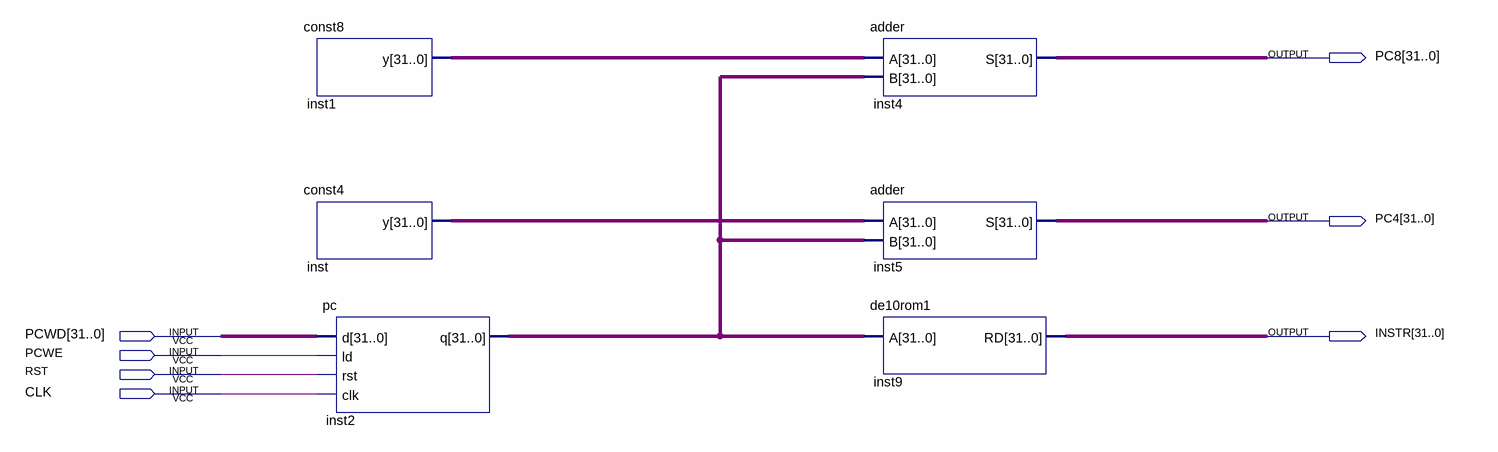
[diagram p0: schematic sheet]
// Quartus schematic fetch.bdf as structural Verilog: 6 symbols, 7 pins
module fetch (
  input  [31:0] PCWD,
  input  PCWE,
  input  RST,
  input  CLK,
  output [31:0] PC8,
  output [31:0] PC4,
  output [31:0] INSTR
);

  wire [31:0] inst1_y, inst2_q, inst_y;

  const8 inst1 (.y(inst1_y));
  const4 inst (.y(inst_y));
  pc inst2 (.d(PCWD), .ld(PCWE), .rst(RST), .clk(CLK), .q(inst2_q));
  adder inst4 (.A(inst1_y), .B(inst2_q), .S(PC8));
  adder inst5 (.A(inst_y), .B(inst2_q), .S(PC4));
  de10rom1 inst9 (.A(inst2_q), .RD(INSTR));
endmodule
